# EasyEDA Pro project ProPrj_Business Card Macro Pad_2025-06-18.epro, board PCB1
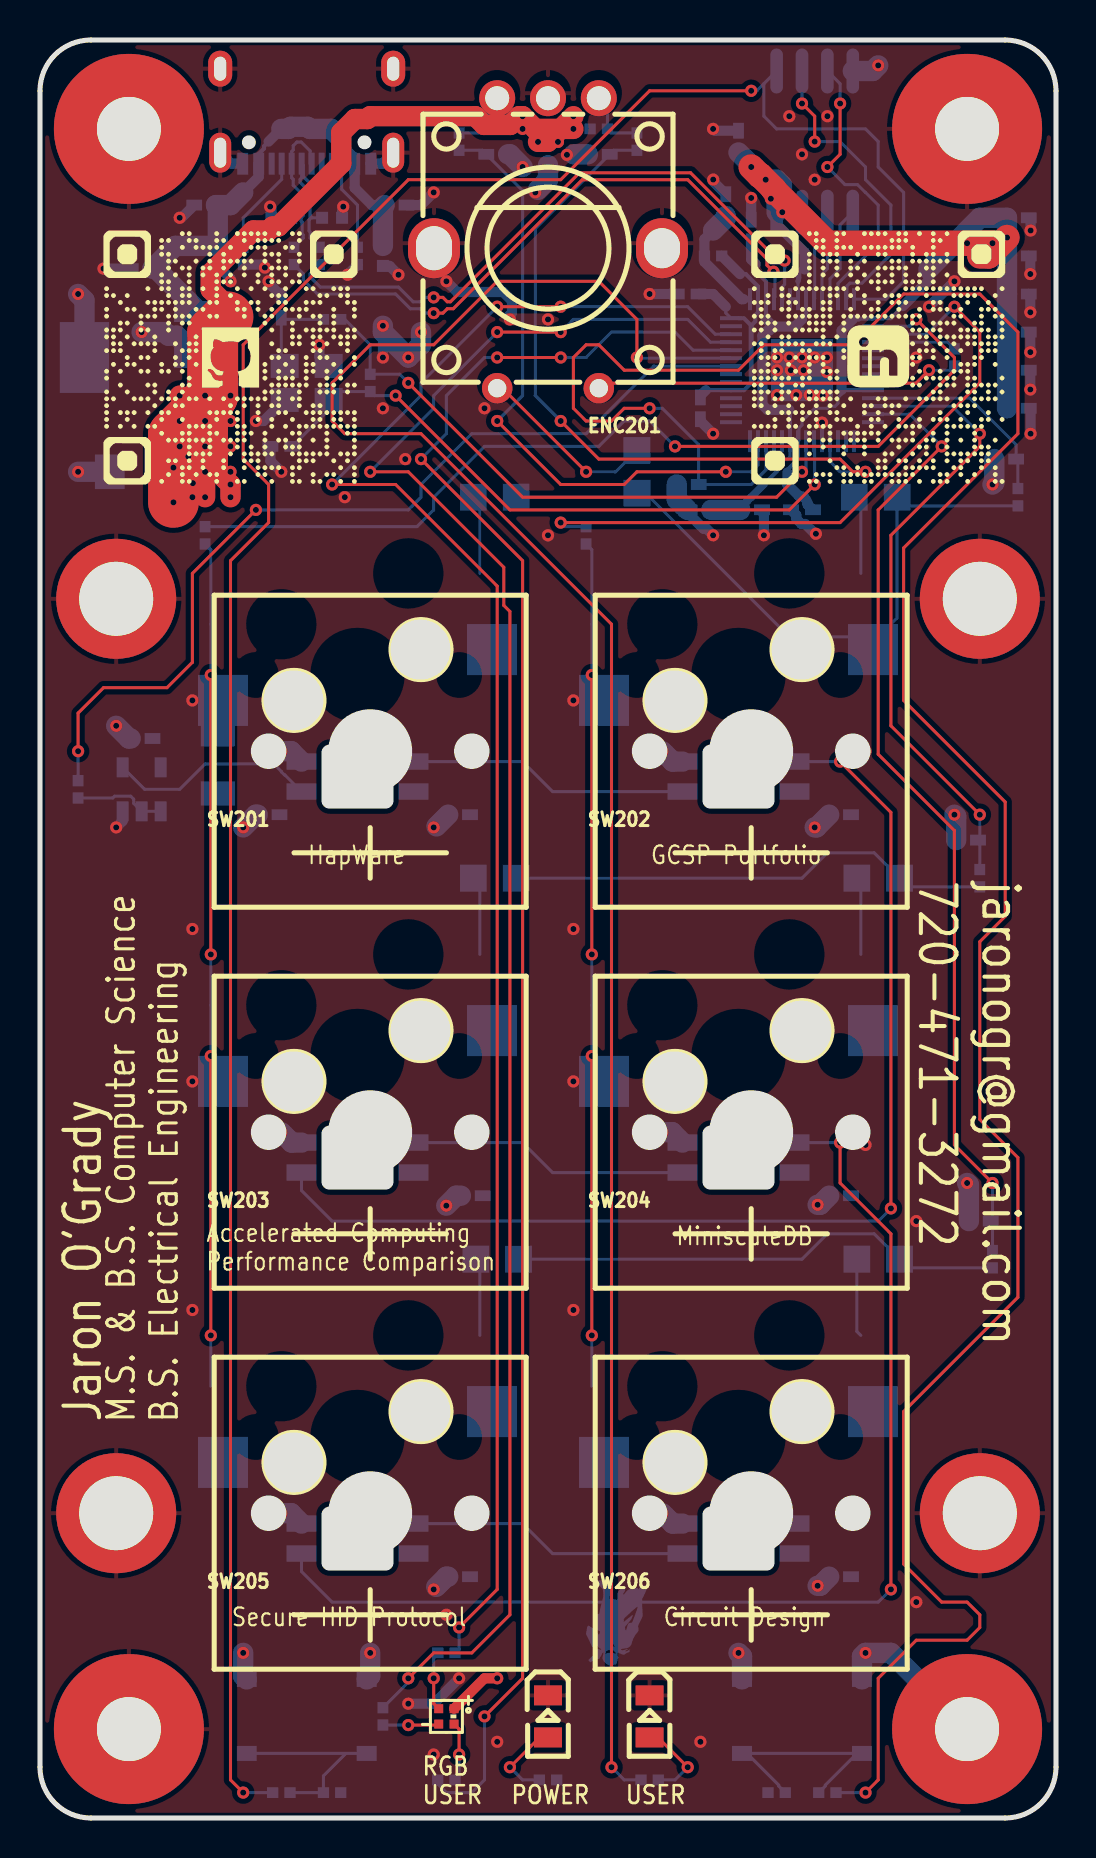
[diagram p2: board, top side]
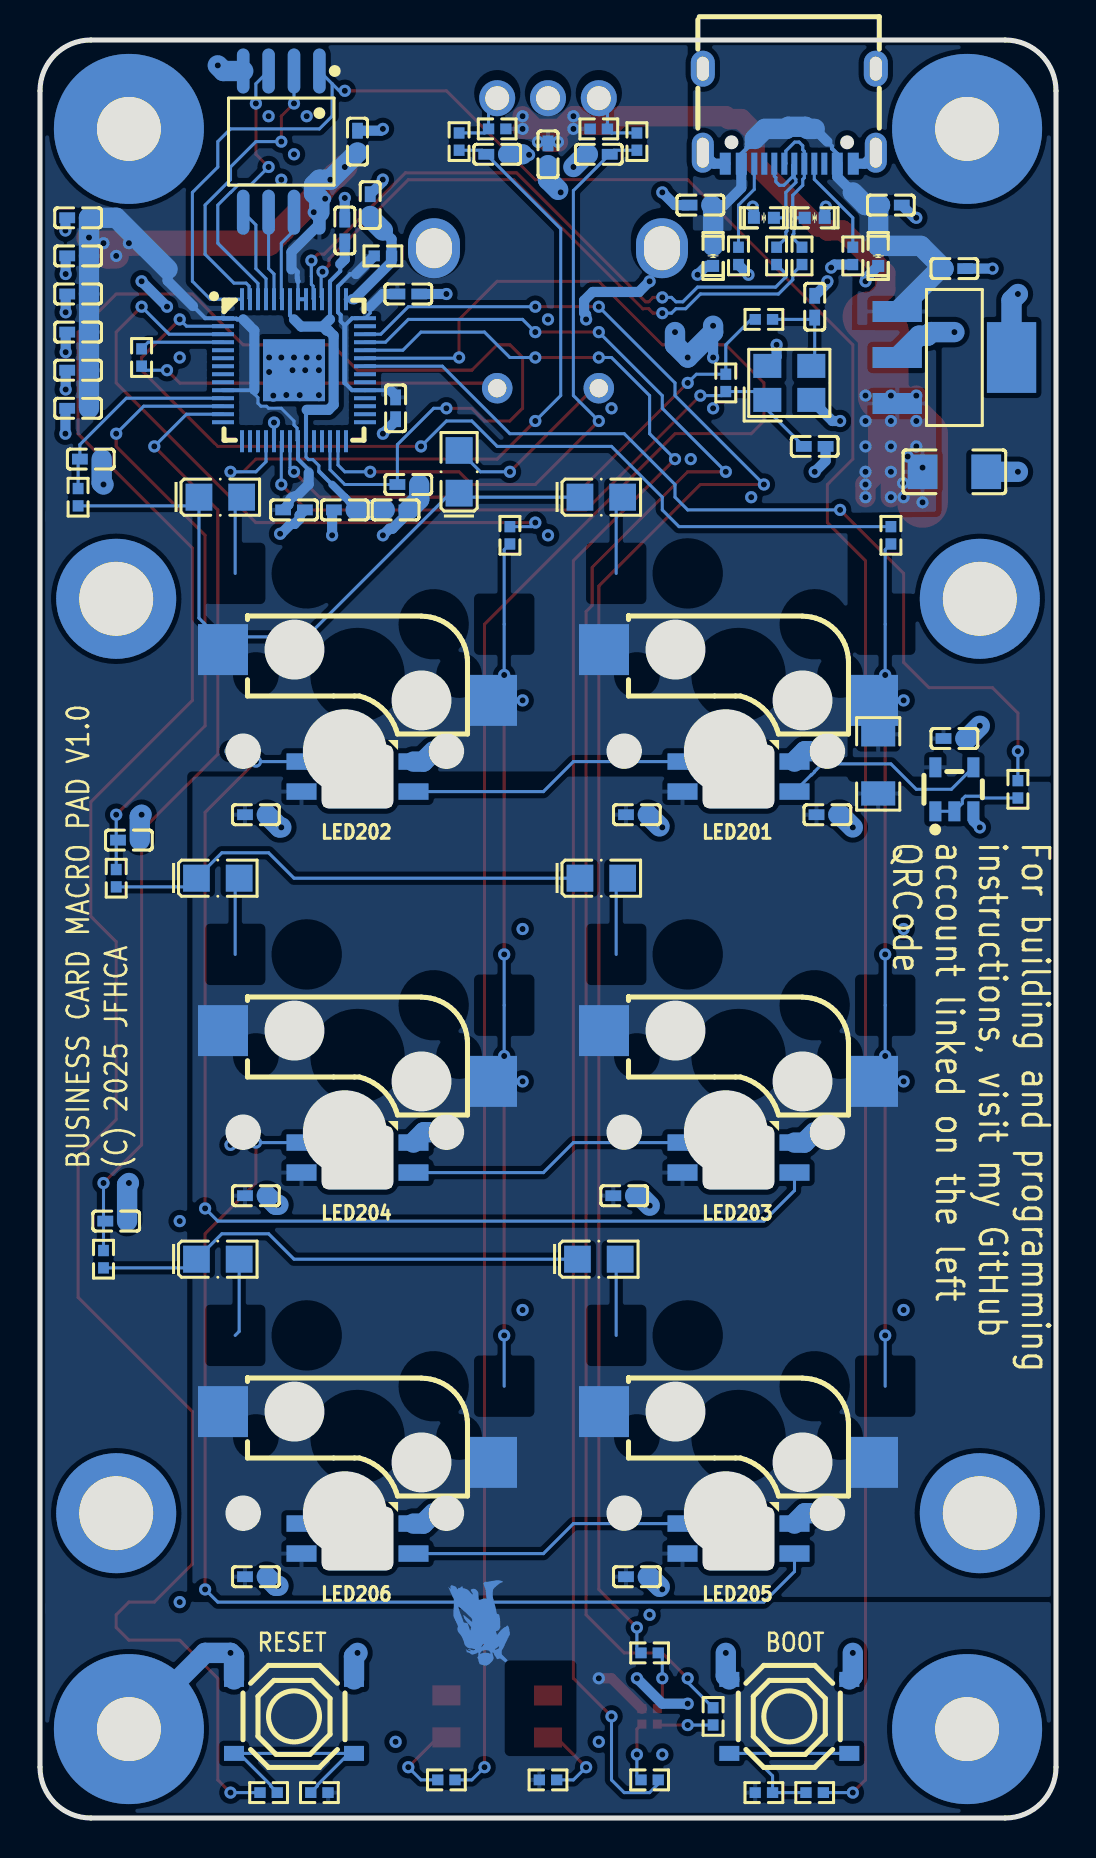
[diagram p3: board, bottom side, seen from below]

Outline 50.8 x 88.9 mm; copper layers: Top Layer, Inner1, Inner2, Bottom Layer. Coordinates in mm from the lower left corner of the outline.
Outline path: 0,86.36 arc(0.74,88.16) 2.54,88.9 48.26,88.9 arc(50.06,88.16) 50.8,86.36 50.8,2.54 arc(50.06,0.74) 48.26,0 2.54,0 arc(0.74,0.74) 0,2.54 0,86.36
Stack: Top Layer 0.035mm Outer layer thickness 1oz / Dielectric1 0.2104mm 7628 RC49% 8.6mil / Inner1 0.0152mm Inner layer thickness / Dielectric2 1.065mm 1.1mm H/HOZ Copper / Inner2 0.0152mm Inner layer thickness / Dielectric3 0.2104mm 7628 RC49% 8.6mil / Bottom Layer 0.035mm Outer layer thickness 1oz

## Design rules (mm)
net CONN_USB_N: DP1
net CONN_USB_P: DP1
net USB_N: DP2
net USB_P: DP2
template: Custom Config
spacing copperThickness1oz (default): track to track 0.178, other pairs 0.178 to 0.305
spacing copperThickness2oz: track to track 0.203, other pairs 0.152 to 0.3
track width copperThickness1oz: min 0.127, default 0.254, max 2.54
track width copperThickness2oz (default): min 0.127, default 0.152, max 2.54
differential pair differentialPair (default): width min 0.155, default 0.155, max 0.203; gap min 0.178, default 0.191
via viaSize (default): diameter min 0.61, default 0.61, max 10; hole min 0.305, default 0.305, max 6.299

## Placement (name value [footprint] x y rotation side)
C101  2.2uF  [C0402]  34.29 80.64 270 bottom
C102  1uF  [C0402]  11.43 50.17 0 bottom
C103  1uF  [C0402]  5.08 77.47 0 bottom
C104  100nF  [C0402]  35.56 79.38 270 bottom
C105  100nF  [C0402]  35.56 65.41 180 bottom
C106  2.2uF  [C0402]  33.02 65.41 0 bottom
C107  2.2uF  [C0402]  48.9 80.01 180 bottom
C108  2.2uF  [C0402]  32.38 76.2 0 bottom
C109  100nF  [C0402]  48.9 76.2 180 bottom
C110  100nF  [C0402]  48.9 78.11 180 bottom
C111  100nF  [C0402]  48.9 74.3 180 bottom
C112  100nF  [C0402]  33.02 70.48 90 bottom
C113  100nF  [C0402]  38.1 65.41 0 bottom
C114  100nF  [C0402]  48.9 70.48 180 bottom
C115  100nF  [C0402]  48.9 72.39 180 bottom
C116  47uF  [C1206]  5.08 67.31 0 bottom
C117  100nF  [C0402]  48.26 67.94 0 bottom
C118  100nF  [C0402]  46.35 48.89 0 bottom
C119  1uF  [C0402]  17.78 80.64 180 bottom
C120  1uF  [C0402]  8.25 80.64 0 bottom
C121  100nF  [C0402]  46.99 29.84 0 bottom
C123  15pF  [C0402]  12.06 68.58 180 bottom
C124  15pF  [C0402]  12.06 75.56 90 bottom
C125  100nF  [C0402]  34.93 83.82 270 bottom
C126  100nF  [C0402]  32.38 66.67 0 bottom
C127  100nF  [C0402]  5.08 53.97 0 bottom
C201  2.2uF  [C0402]  25.4 83.19 90 bottom
C203  10nF  [C0402]  27.94 83.19 0 bottom
C205  10nF  [C0402]  22.86 83.19 180 bottom
C210  100nF  [C0402]  20.96 50.17 0 bottom
C211  100nF  [C0402]  40 50.17 0 bottom
C212  100nF  [C0402]  21.59 31.11 0 bottom
C213  100nF  [C0402]  40 31.11 0 bottom
C214  100nF  [C0402]  20.96 12.06 0 bottom
C215  100nF  [C0402]  40 12.06 0 bottom
D101  GG0402052R542P  [D0402-BI]  12.06 80.01 180 bottom
D102  GG0402052R542P  [D0402-BI]  8.89 78.11 90 bottom
D103  GG0402052R542P  [D0402-BI]  17.15 78.11 90 bottom
D104  GG0402052R542P  [D0402-BI]  14.6 80.01 180 bottom
D201  CD4148WSP  [D0805-RD]  22.74 66.04 180 bottom
D202  CD4148WSP  [D0805-RD]  41.79 66.04 180 bottom
D203  CD4148WSP  [D0805-RD]  22.74 46.99 180 bottom
D204  CD4148WSP  [D0805-RD]  41.91 46.99 180 bottom
D205  CD4148WSP  [D0805-RD]  22.86 27.94 180 bottom
D206  CD4148WSP  [D0805-RD]  41.91 27.94 180 bottom
D210  CD4148WSP  [D0805-RD]  29.84 67.31 90 bottom
ENC201  PEC12R-4120F-S0012  [SW-TH_PEC12R-4120F-S0012]  25.4 78.74 180 top
J101  TYPE-C 16PIN 2MD(073)  [USB-C-SMD_TYPE-C-6PIN-2MD-073]  13.34 85.09 0 bottom
J201  CPG151101S11-16  [SMD_KEYBOARD-SW]  15.88 57.15 0 bottom
J202  CPG151101S11-16  [SMD_KEYBOARD-SW]  34.93 57.15 0 bottom
J203  CPG151101S11-16  [SMD_KEYBOARD-SW]  15.88 38.1 0 bottom
J204  CPG151101S11-16  [SMD_KEYBOARD-SW]  34.93 38.1 0 bottom
J205  CPG151101S11-16  [SMD_KEYBOARD-SW]  15.88 19.05 0 bottom
J206  CPG151101S11-16  [SMD_KEYBOARD-SW]  34.93 19.05 0 bottom
LED101  NH-B1010RGBT-HF  [LED-ARRAY-SMD_4P-L1.0-W1.0-TR_NH-B1010RGBT]  20.32 5.08 0 top
LED102  KT-0805G  [LED0805-R-RD]  25.4 5.08 270 top
LED103  KT-0805Y  [LED0805-R-RD]  30.48 5.08 270 top
LED201  SK6812MINI-E  [LED-SMD_L3.2-W2.8-LS5.9_SK6812MINI-E]  15.88 52.07 0 bottom
LED202  SK6812MINI-E  [LED-SMD_L3.2-W2.8-LS5.9_SK6812MINI-E]  34.93 52.07 0 bottom
LED203  SK6812MINI-E  [LED-SMD_L3.2-W2.8-LS5.9_SK6812MINI-E]  15.88 33.02 0 bottom
LED204  SK6812MINI-E  [LED-SMD_L3.2-W2.8-LS5.9_SK6812MINI-E]  34.93 33.02 0 bottom
LED205  SK6812MINI-E  [LED-SMD_L3.2-W2.8-LS5.9_SK6812MINI-E]  15.88 13.97 0 bottom
LED206  SK6812MINI-E  [LED-SMD_L3.2-W2.8-LS5.9_SK6812MINI-E]  34.93 13.97 0 bottom
MH201  STANDOFF_M2.5X3.2MM  [STANDOFF_M2.5X3.5MM_JO_v1.0]  3.81 15.24 0 top
MH202  STANDOFF_M2.5X3.2MM  [STANDOFF_M2.5X3.5MM_JO_v1.0]  46.99 15.24 0 top
MH203  STANDOFF_M2.5X3.2MM  [STANDOFF_M2.5X3.5MM_JO_v1.0]  3.81 60.96 0 top
MH204  STANDOFF_M2.5X3.2MM  [STANDOFF_M2.5X3.5MM_JO_v1.0]  46.99 60.96 0 top
MH205  -  [MH_7.5X3.2MM_JO_v1.0]  4.44 4.44 0 top
MH206  -  [MH_7.5X3.2MM_JO_v1.0]  4.44 84.45 0 top
MH207  -  [MH_7.5X3.2MM_JO_v1.0]  46.35 84.45 0 top
MH208  -  [MH_7.5X3.2MM_JO_v1.0]  46.35 4.44 0 top
R101  1kΩ  [R0402]  25.4 1.91 0 bottom
R102  1kΩ  [R0402]  30.48 1.91 180 bottom
R103  1kΩ  [R0402]  20.32 1.91 180 bottom
R104  1kΩ  [R0402]  17.15 5.08 90 bottom
R105  1kΩ  [R0402]  20.32 8.25 0 bottom
R106  200Ω  [R0402]  33.66 78.11 0 bottom
R107  100mΩ  [R1206]  8.89 52.7 270 bottom
R108  27Ω  [R0402]  8.25 64.14 270 bottom
R109  27Ω  [R0402]  12.7 78.11 270 bottom
R110  27Ω  [R0402]  27.31 64.14 270 bottom
R111  27Ω  [R0402]  13.97 78.11 270 bottom
R112  27Ω  [R0402]  45.72 73.03 270 bottom
R113  5.1kΩ  [R0402]  10.16 78.11 270 bottom
R114  0Ω  [R0402]  48.9 66.04 270 bottom
R115  0Ω  [R0402]  46.99 46.99 270 bottom
R116  5.1kΩ  [R0402]  15.88 78.11 90 bottom
R117  0Ω  [R0402]  47.62 27.94 270 bottom
R118  27Ω  [R0402]  1.91 51.44 270 bottom
R120  1MΩ  [R0402]  16.51 71.75 270 bottom
R121  1kΩ  [R0402]  14.6 74.93 0 bottom
R122  100kΩ  [R0402]  14.6 1.27 0 bottom
R123  10kΩ  [R0402]  36.83 1.27 180 bottom
R124  1kΩ  [R0402]  12.06 1.27 180 bottom
R125  27Ω  [R0402]  39.37 1.27 0 bottom
R201  10kΩ  [R0402]  27.94 84.45 180 bottom
R202  10kΩ  [R0402]  22.86 84.45 0 bottom
R205  10kΩ  [R0402]  29.84 83.82 90 bottom
R207  10kΩ  [R0402]  20.96 83.82 90 bottom
SW101  TS-1187A-B-A-B  [SW-SMD_4P-L5.1-W5.1-P3.70-LS6.5-TL_H1.5]  13.34 5.08 180 bottom
SW102  TS-1187A-B-A-B  [SW-SMD_4P-L5.1-W5.1-P3.70-LS6.5-TL_H1.5]  38.1 5.08 180 bottom
SW201  CPG151101D213  [KEY-TH_CPG151101D21X]  15.88 57.15 0 top
SW202  CPG151101D213  [KEY-TH_CPG151101D21X]  34.93 57.15 0 top
SW203  CPG151101D213  [KEY-TH_CPG151101D21X]  15.88 38.1 0 top
SW204  CPG151101D213  [KEY-TH_CPG151101D21X]  34.93 38.1 0 top
SW205  CPG151101D213  [KEY-TH_CPG151101D21X]  15.88 19.05 0 top
SW206  CPG151101D213  [KEY-TH_CPG151101D21X]  34.93 19.05 0 top
U101  RP2040  [LQFN-56_L7.0-W7.0-P0.4-EP]  38.1 72.39 180 bottom
U102  LM3940IMP-3.3/NOPB  [SOT-223_L6.5-W3.5-P2.30-LS7.0-BR]  5.08 73.03 0 bottom
U103  W25Q128JVSIQ  [SOIC-8_L5.3-W5.3-P1.27-LS8.0-BL]  38.74 83.82 0 bottom
U104  SN74LV1T34DBVR  [SOT-23-5_L2.9-W1.6-P0.95-LS2.8-BR]  5.08 51.44 270 bottom
Y101  ABM8-272-T3  [CRYSTAL-SMD_4P-L3.2-W2.5-BL]  13.34 71.75 180 bottom

## Footprints (pads in the part's own frame, mm; a bottom-side part is the same pattern mirrored in y, then rotated)
C0402
  rect 0.79x0.54 smd: 1(-0.545,0) 2(0.545,0)
C1206
  rect 1.485x1.728 smd: 1(-1.593,0) 2(1.593,0)
CRYSTAL-SMD_4P-L3.2-W2.5-BL
  rect 1.4x1.2 smd: 1(-1.1,-0.85) 2(1.1,-0.85) 3(1.1,0.85) 4(-1.1,0.85)
D0402-BI
  rect 0.6x0.6 smd: 1(-0.5,0) 2(0.5,0)
D0805-RD
  rect 1.335x1.35 smd: 1(-1.067,0) 2(1.067,0)
LED0805-R-RD
  rect 1x1.399 smd: 1(1.05,0) 2(-1.05,0)
LED-ARRAY-SMD_4P-L1.0-W1.0-TR_NH-B1010RGBT
  rect 0.45x0.45 smd: 1(0.385,0.385) 2(0.385,-0.385) 3(-0.385,-0.385) 4(-0.385,0.385)
LED-SMD_L3.2-W2.8-LS5.9_SK6812MINI-E
  rect 1.5x0.82 smd: 1(2.8,0.75) 2(2.8,-0.75) 3(-2.8,-0.75) 4(-2.8,0.75)
LQFN-56_L7.0-W7.0-P0.4-EP
  rect 1.1x0.2 smd: 1(-3.55,2.6) 2(-3.55,2.2) 3(-3.55,1.8) 4(-3.55,1.4) 5(-3.55,1) 6(-3.55,0.6) 7(-3.55,0.2) 8(-3.55,-0.2) 9(-3.55,-0.6) 10(-3.55,-1) 11(-3.55,-1.4) 12(-3.55,-1.8) 13(-3.55,-2.2) 14(-3.55,-2.6) 29(3.55,-2.6) 30(3.55,-2.2) 31(3.55,-1.8) 32(3.55,-1.4) 33(3.55,-1) 34(3.55,-0.6) 35(3.55,-0.2) 36(3.55,0.2) 37(3.55,0.6) 38(3.55,1) 39(3.55,1.4) 40(3.55,1.8) 41(3.55,2.2) 42(3.55,2.6)
  rect 0.2x1.1 smd: 15(-2.6,-3.55) 16(-2.2,-3.55) 17(-1.8,-3.55) 18(-1.4,-3.55) 19(-1,-3.55) 20(-0.6,-3.55) 21(-0.2,-3.55) 22(0.2,-3.55) 23(0.6,-3.55) 24(1,-3.55) 25(1.4,-3.55) 26(1.8,-3.55) 27(2.2,-3.55) 28(2.6,-3.55) 43(2.6,3.55) 44(2.2,3.55) 45(1.8,3.55) 46(1.4,3.55) 47(1,3.55) 48(0.6,3.55) 49(0.2,3.55) 50(-0.2,3.55) 51(-0.6,3.55) 52(-1,3.55) 53(-1.4,3.55) 54(-1.8,3.55) 55(-2.2,3.55) 56(-2.6,3.55)
  rect 3.1x3.1 smd: 57(0,0)
MH_7.5X3.2MM_JO_v1.0
  round 7.5 hole 3.2: 1(0,0)
R0402
  rect 0.566x0.54 smd: 1(-0.433,0) 2(0.433,0)
R1206
  rect 1.208x1.701 smd: 1(-1.479,0) 2(1.479,0)
SMD_KEYBOARD-SW
  rect 2.5x2.55 smd: 1(-6.725,1.27) 2(6.725,-1.27)
SOIC-8_L5.3-W5.3-P1.27-LS8.0-BL
  oval 0.63x2.25 smd: 1(-1.905,-3.53) 2(-0.635,-3.53) 3(0.635,-3.53) 4(1.905,-3.53) 5(1.905,3.53) 6(0.635,3.53) 7(-0.635,3.53) 8(-1.905,3.53)
SOT-23-5_L2.9-W1.6-P0.95-LS2.8-BR
  rect 1x0.6 smd: 1(1.1,-0.95) 2(1.1,0) 3(1.1,0.95) 4(-1.1,0.95) 5(-1.1,-0.95)
SOT-223_L6.5-W3.5-P2.30-LS7.0-BR
  rect 2.465x1.05 smd: 1(2.857,-2.3) 2(2.857,0) 3(2.857,2.3)
  rect 2.465x3.54 smd: 4(-2.857,0)
STANDOFF_M2.5X3.5MM_JO_v1.0
  round 6 hole 3.7: 1(0,0)
SW-SMD_4P-L5.1-W5.1-P3.70-LS6.5-TL_H1.5
  rect 1x0.75 smd: 1(-3,1.85) 2(3,1.85) 3(-3,-1.85) 4(3,-1.85)
SW-TH_PEC12R-4120F-S0012
  round 1.524 hole 0.914: 1(-2.54,7.25) 2(2.54,7.25)
  oval 2.6x3 hole 1.8x2.2: 3(5.7,0.25)
  oval 2.6x3 hole 1.8x2: 4(-5.7,0.25)
  round 1.8 hole 1.2: A(-2.54,-7.25) B(2.54,-7.25) C(0,-7.25)
USB-C-SMD_TYPE-C-6PIN-2MD-073
  rect 0.55x1.1 smd: 1(-3.2,2.375) 2(-2.4,2.375) 11(2.4,2.375) 12(3.2,2.375)
  rect 0.3x1.1 smd: 3(-1.75,2.375) 4(-1.25,2.375) 5(-0.75,2.375) 6(-0.25,2.375) 7(0.25,2.375) 8(0.75,2.375) 9(1.25,2.375) 10(1.75,2.375)
  oval 1.2x1.8 hole 0.6x1.2: 13(-4.325,-2.375) 14(4.325,-2.375)
  oval 1.1x2 hole 0.6x1.5: 13(-4.325,1.825) 14(4.325,1.825)

## Nets
As in the schematic.

Pads without a net: J101 3 9; LED206 2; U101 5 6 7 8 9 14 15 16 17 28 29 30 31 32 34 35 41

## Via types
v1: diameter 0.61, hole 0.305, Top Layer to Bottom Layer, 204 vias

## Routing (per net, layer and track width the routed paths; a pad name or vN(x,y) marks a point on that pad's centre or on a via; arc(x,y) is an arc through that point)
+1V1: length 20.7
  Bottom Layer w0.152: 36.83,67.31 36.86,67.34 36.86,67.62 37.15,67.92 37.37,67.92 37.5,68.05 U101.23
  Bottom Layer w0.203: 38.1,74.93 38.3,75.13 U101.50 ; 36.3,74.93 U101.45 36.3,76.83 35.79,77.35 35.79,77.7 ; 37.47,70.41 37.5,70.37 U101.23 ; 36.83,67.31 36.19,66.67
  Bottom Layer w0.381: C105.2 35.01,65.5 35.34,65.82 35.34,65.83 35.56,66.04 35.56,66.04 36.19,66.67
  Bottom Layer w0.508: 35.79,77.7 35.56,77.93 C104.2 ; 36.66,74.57 36.46,74.37 36.37,74.37 36.12,74.12 36.12,70.66 36.37,70.41 37.47,70.41 ; 36.66,74.57 37.74,74.57 38.1,74.93 ; 36.66,74.57 36.3,74.93
  Bottom Layer w1.016: C106.2 C105.2
+3V3: length 123.4
  Top Layer w0.508: v1(22.86,6.99) 22.22,6.99 LED101.1
  Top Layer w1.016: 26.03,84.45 25.39,83.81 v1(24.9,83.81) ; 26.03,84.45 v1(26.67,85.09) ; 26.03,84.45 v1(26.67,84.45) ; 26.03,84.45 24.76,84.45 v1(24.13,85.09) 23.95,85.09 23.52,84.65 22.2,84.65 21.77,85.09 16.51,85.09 16.37,84.95 15.74,84.95 15.06,84.27 15.06,82.72 11.92,79.58 11.63,79.58 11.43,79.38 10.66,79.38 8.53,77.25 8.53,76.42 9.4,75.56 9.4,75.06 ; v1(8.25,69.85) v1(6.98,71.12) ; v1(8.25,69.85) 8.89,69.85 8.89,67.31 v1(9.53,66.67) v1(9.53,66.04) ; v1(8.25,69.85) v1(8.25,68.58) v1(8.25,67.31) v1(8.25,66.04)
  Top Layer w1.27: v1(47.62,78.74) v1(46.35,78.74) 39.37,78.74 36.68,81.43 36.68,81.47 36.02,82.12 35.99,82.12 v1(35.56,82.55) ; v1(46.99,78.11) 47.43,78.11 v1(48.35,79.02)
  Top Layer w2.54: v1(6.67,65.78) v1(6.67,67.52) 6.67,69.16 8.64,71.12 8.64,74.29 9.4,75.06
  Bottom Layer w0.152: U101.49 37.9,76.83 ; 40.08,71.4 40.08,71.2 39.9,71.02 39.9,70.73 39.75,70.59 39.47,70.59 39.37,70.48 38.74,70.48 38.1,69.85 38.1,69.65 37.95,69.5 37.95,68.89 U101.22 ; 35.19,74.99 35.22,74.97 ; C112.2 33.02,71.12 ; 34.29,75.56 34.29,75.25 U101.42 34.93,74.99
  Bottom Layer w0.203: 43.15,75.59 42.54,74.99 U101.1 41.63,74.97 40.98,74.97 40.94,74.93 40.64,74.93 ; 35.56,71.75 35.19,71.39 U101.33 33.29,71.39 ; U101.10 40.09,71.39 40.08,71.4 ; 35.22,74.97 35.56,74.62 35.77,74.83 35.77,75.15 35.9,75.28 U101.44 35.9,76.58 35.29,77.19 35,77.19 ; U101.48 U101.49 ; 34.93,74.99 35.19,74.99 ; U101.22 37.9,67.94 37.37,67.41
  Bottom Layer w0.254: 35.56,74.62 35.56,71.75 ; 37.9,76.83 37.9,76.84 arc(37.93,76.92) 37.94,77.01 37.94,77.31 38.06,77.43 38.23,77.43
  Bottom Layer w0.508: 40.08,71.4 40.08,74.37 40.64,74.93 ; C113.2 38.38,65.67 38.38,65.67 arc(38.26,65.98) 37.95,66.11 37.94,66.11 37.37,66.69 37.37,67.26 ; 44.42,77.44 44.42,76.86 43.15,75.59 ; U103.8 36.83,79.69 38.23,78.3 38.23,77.43 ; 33.02,71.12 33.29,71.39 ; 34.29,75.56 33.66,76.2 C108.2 ; 35,77.19 R106.2
  Bottom Layer w1.016: U103.8 36.83,80.96 37.1,81.23 37.1,81.65 36.83,81.92 v1(36.28,81.92) 34.93,83.28 ; C114.2 C115.2 C111.2 C109.2 C110.2 v1(48.35,79.02) C107.2 46.99,80.01 44.42,77.44
  vias: v1(6.98,69.85) v1(6.98,68.58) v1(7.42,68.07) v1(7.64,66.74) v1(7.62,66.04) v1(8.25,71.12) v1(9.53,71.12) v1(9.53,69.85) v1(9.53,68.58) v1(9.53,67.31) v1(24.13,84.45) v1(25.9,83.81) v1(36.54,80.96) v1(37.11,80.29)
+3V3_A: length 5.8
  Bottom Layer w0.229: U101.43 35.19,75.94
  Bottom Layer w0.508: 35.19,75.94 35.09,75.94 33.22,77.81 R106.1 33.22,78.94 33.66,79.38
  Bottom Layer w1.016: 33.66,79.38 34.29,80.01 C101.2
+5V_USB: length 24.6
  Bottom Layer w0.203: 11.43,83.82 11.2,83.59 11.2,83.47 10.94,83.21 J101.2 ; 15.32,83.7 15.47,83.54 15.47,83.47 15.74,83.21 J101.11
  Bottom Layer w0.508: J101.11 15.74,81.5 16.59,80.64 C119.2 ; 15.06,83.95 15.32,83.7 ; J101.2 10.94,82.06 10.16,81.28 ; 11.43,83.82 12.06,84.45
  Bottom Layer w1.016: D103.2 17.15,80.56 C119.2 ; 12.06,84.45 12.42,84.45 12.53,84.56 13.38,84.56 13.49,84.45 14.56,84.45 15.06,83.95 ; 10.16,81.28 9.53,80.64 C120.2 8.89,80.56 D102.2 6.76,78.61 C103.2 5.79,77.47 U102.1
GND: length 95.7
  Bottom Layer w0.203: U101.19 v1(39.1,69.77)
  Bottom Layer w0.508: J101.14 17.11,82.72 J101.12 ; v1(49.52,75.29) 49.52,76.12 C109.1 ; U104.3 4.13,49.85 v1(3.81,49.53) ; C125.1 33.75,84.36 v1(33.66,84.45) ; C107.1 49.53,79.92 v1(49.53,79.38) ; v1(6.98,80.01) 7.08,80.01 C120.1 ; v1(9.53,76.83) 9.53,76.97 D102.1 ; D104.1 15.1,80.51 v1(15.16,80.57) ; 17.15,74.3 v1(17.15,73.03) ; C124.2 11.43,76.75 v1(11.43,76.83) ; C111.1 49.52,74.22 v1(49.52,73.29) ; v1(18.41,5.72) 19.69,5.72 v1(20.96,6.99) ; v1(19.69,81.28) 19.05,80.64 C119.1 ; v1(49.52,77.2) 49.52,78.03 C110.1 ; v1(49.52,71.42) 49.52,72.31 C115.1 ; v1(17.92,77.16) 17.48,77.61 D103.1 ; D101.2 11.56,80.51 v1(11.51,80.57) ; C112.1 33.02,69.85 v1(33.66,69.22) ; R116.1 15.88,77.66 v1(15.38,77.16) ; v1(49.53,69.22) 49.53,70.39 C114.1 ; C108.1 v1(30.48,76.2) ; v1(11.24,77.52) 11.09,77.67 R113.2 ; v1(44.45,75.56) v1(45.72,76.83) ; C123.2 11.52,67.86 v1(12.06,67.31) ; v1(36.19,64.14) 36.19,65.31 C105.1 ; 10.13,82.72 9.56,82.72 J101.13 ; C103.1 v1(3.17,77.47) ; v1(33.66,64.14) 33.32,64.47 33.18,64.47 32.47,65.17 C106.1 ; Y101.4 13.97,73.07 v1(13.97,73.66) ; v1(20.32,76.83) 20.85,76.3 23.16,76.3 23.6,75.87 23.6,75.26 23.5,75.16 v1(23.5,74.93) ; v1(33.66,81.92) 33.66,81.82 C101.1 ; C104.1 v1(35.56,81) ; Y101.2 11.18,69.85 v1(10.79,69.85) ; v1(38.8,64.21) 38.75,64.21 38.26,64.7 38.07,64.7 37.82,64.96 37.82,65.14 C113.1
  Bottom Layer w1.016: v1(45.72,50.17) 45.81,50.08 C118.1 ; v1(17.15,74.61) 17.15,74.3 v1(18.41,73.03) 19.05,73.66 v1(19.05,74.3) ; LED206.3 31.63,14.72 v1(31.12,15.24) ; v1(38.88,30.66) 39.01,30.66 C213.1 ; LED204.3 31.6,34.29 v1(31.12,34.29) ; v1(5.08,74.3) 6.24,74.3 6.42,74.11 6.85,74.11 U102.2 ; v1(20.31,30.62) 20.81,31.11 21.04,31.11 ; v1(10.16,49.53) 10.79,50.17 10.88,50.17 ; LED202.3 31.63,52.82 v1(31.12,53.34) ; 24.89,81.41 25.4,81.92 C201.1 ; 19.81,11.56 20.32,12.06 C214.1 ; v1(1.91,76.2) 2.22,75.88 U102.4 ; LED203.3 12.59,33.77 v1(12.06,34.29) ; 12.13,53.34 12.56,53.34 LED201.3 ; C116.1 v1(1.91,67.31) ; v1(10.16,8.25) 10.16,7.1 SW101.2 ; v1(3.81,54.61) 4.44,53.97 C127.1 ; SW102.1 41.1,8.08 v1(41.28,8.25) 42.54,8.25 MH208.1 ; v1(38.88,11.61) 39.01,11.61 C215.1 ; v1(24.13,82.55) 23.5,83.19 C205.1 ; v1(16.51,8.25) 16.51,7.1 SW101.1 ; C211.1 38.82,49.53 v1(38.74,49.53) ; C203.1 26.68,83.19 ; v1(34.93,8.25) 35.1,8.08 SW102.2 ; 32.37,65.41 31.84,65.94 C126.1 ; C210.1 19.83,49.58 ; v1(46.35,31.75) 46.44,31.66 46.44,29.84 ; LED205.3 12.56,15.24 v1(12.06,15.24) ; v1(47.62,66.67) 47.72,66.77 C117.1 ; v1(41.91,87.63) 41.63,87.35 U103.4
  vias: v1(7.62,55.88) v1(7.62,44.45) v1(7.62,36.83) v1(7.62,25.4) v1(12.06,53.34) v1(15.24,66.04) v1(17.15,70.48) v1(18.26,67.94) v1(19.69,49.53) v1(19.69,11.43) v1(19.69,3.18) v1(20.32,10.16) v1(22.22,70.48) v1(22.86,3.81) v1(24.76,81.28) v1(25.4,74.93) v1(25.4,64.14) v1(26.35,83.16) v1(26.67,55.88) v1(26.67,44.45) v1(26.67,36.83) v1(26.67,25.4) v1(33.02,3.81) v1(36.85,73.03) v1(36.85,72.39) v1(36.85,71.14) v1(37.47,85.09) v1(37.47,73.03) v1(37.54,72.39) v1(37.81,71.14) v1(38.1,83.19) v1(38.1,73.03) v1(38.18,72.39) v1(38.48,71.15) v1(38.74,81.92) v1(38.74,73.03) v1(39.14,71.12) v1(39.34,73.03) v1(39.34,72.3) v1(39.37,85.09) v1(41.28,53.34) v1(41.28,33.66) v1(43.81,73.03) v1(43.81,29.84) v1(43.81,10.79)
COL0: length 42.2
  Top Layer w0.152: v1(8.54,24.13) v1(8.54,38.1) ; v1(8.54,43.18) v1(8.54,57.15)
  Bottom Layer w0.152: 8.54,21.59 v1(8.54,24.13) ; R108.2 8.54,63.42 v1(8.54,57.15) ; v1(8.54,43.18) v1(8.54,38.1)
COL0_R: length 47.8
  Top Layer w0.152: v1(31.75,68.58) 41.91,68.58 45.72,72.39 45.72,73.03 v1(43.81,74.93)
  Bottom Layer w0.152: R108.1 18.85,64.57 19.69,65.41 19.69,66.04 22.22,68.58 27.94,68.58 29.21,69.85 30.48,69.85 v1(31.75,68.58) ; U101.2 43.47,74.59 v1(43.81,74.93)
COL1: length 42.2
  Top Layer w0.152: v1(27.59,43.18) v1(27.59,57.15) ; v1(27.59,24.13) v1(27.59,38.1)
  Bottom Layer w0.152: R110.2 27.59,63.42 v1(27.59,57.15) ; 27.59,21.59 v1(27.59,24.13) ; v1(27.59,43.18) v1(27.59,38.1)
COL1_R: length 34.2
  Top Layer w0.152: v1(26.03,64.77) 40,64.77 46.99,71.75 46.99,74.3 v1(45.72,75.56)
  Bottom Layer w0.152: U101.3 44.34,74.19 v1(45.72,75.56) ; v1(26.03,64.77) 26.24,64.57 R110.1
COL2: length 18.1
  Top Layer w0.152: 27.94,71.74 43.8,71.74 v1(44.45,72.39)
  Bottom Layer w0.152: R112.2 45.52,72.39 v1(44.45,72.39)
COL2_R: length 4.2
  Bottom Layer w0.152: R112.1 45.39,73.79 U101.4
CONN_USB_N: length 7.9
  Bottom Layer w0.155: 13.05,80.01 13.05,79.86 13.11,79.8 13.11,79.21 13.16,79.16 13.16,79 R109.1 ; 13.05,80.01 13.16,80.12 13.16,81.14 12.66,81.64 12.66,81.93 12.59,82.01 J101.5 12.59,83.33 12.66,83.41 12.66,83.61 12.84,83.8 13.06,83.8 13.51,83.35 13.51,82.72 J101.7 ; 13.05,80.01 D101.1
CONN_USB_P: length 8
  Bottom Layer w0.155: 13.51,80.12 13.62,80.01 D104.2 ; 13.51,80.12 13.51,79.96 13.45,79.91 13.45,79.35 13.51,79.3 13.51,79 R111.1 ; 13.51,80.12 13.51,81.28 13.01,81.78 13.01,81.93 13.09,82.01 J101.6 13.16,82.64 13.16,82.08 13.61,81.63 13.82,81.63 14.01,81.82 14.01,82.02 14.09,82.1 J101.8
ENC1_A: length 36.1
  Top Layer w0.152: v1(26.03,69.85) 27.94,67.94 40,67.94 40.64,67.31 v1(41.28,67.31)
  Bottom Layer w0.152: v1(26.03,69.85) 24.76,71.12 24.76,79.47 C203.2 28.69,83.39 29.84,83.39 ; v1(41.28,67.31) 40,67.31 39.5,67.81 U101.18
ENC1_B: length 32
  Top Layer w0.152: v1(22.86,69.85) 26.03,66.67 29.21,66.67 29.84,67.31 v1(34.29,67.31)
  Bottom Layer w0.152: U101.27 35.9,67.65 35.56,67.31 v1(34.29,67.31) ; 20.96,83.39 22.11,83.39 C205.2 24.13,81.37 24.13,71.12 v1(22.86,69.85)
ENC1_SW: length 9.3
  Top Layer w0.152: v1(27.31,67.31) 22.88,71.74 22.86,71.74
  Bottom Layer w0.152: D210.2 28.78,67.31 v1(27.31,67.31)
LED0_BUF: length 4.6
  Bottom Layer w0.152: R118.2 3.64,51 3.72,51.09 4.54,51.09 4.68,50.94 4.68,50.73 U104.2 U104.1
LED0_DIN: length 10.5
  Bottom Layer w0.152: U104.4 5.23,51.44 6.98,51.44 8.25,52.7 11.69,52.7 12.07,52.32 12.07,52.31 12.22,52.16 12.24,52.16 LED201.4
LED0_RES: length 46.2
  Top Layer w0.152: v1(1.91,53.34) 1.91,55.25 3.17,56.52 6.35,56.52 7.62,57.78 7.62,62.23 v1(10.79,65.41)
  Bottom Layer w0.152: U101.36 30.68,72.59 27.31,69.22 21.59,69.22 19.05,66.67 19.05,66.04 18.41,65.41 v1(10.79,65.41) ; v1(1.91,53.34) R118.1
LED1_DIN: length 14.1
  Bottom Layer w0.152: LED202.4 25.63,51.32 24.13,52.82 LED201.2
LED2_DIN: length 56.9
  Top Layer w0.152: v1(40,52.82) 42.54,50.28 v1(42.54,30.48)
  Bottom Layer w0.152: 37.72,52.82 v1(40,52.82) ; LED203.4 13.07,31.38 14.6,29.84 41.91,29.84 v1(42.54,30.48)
LED3_DIN: length 14.1
  Bottom Layer w0.152: LED204.4 25.63,32.27 24.13,33.77 LED203.2
LED4_DIN: length 56.9
  Top Layer w0.152: v1(42.54,11.43) 42.54,29.21 40,31.75 v1(40,33.77)
  Bottom Layer w0.152: 37.72,33.77 v1(40,33.77) ; v1(42.54,11.43) 41.91,10.79 14.6,10.79 13.07,12.32 LED205.4
LED5_DIN: length 14.1
  Bottom Layer w0.152: LED206.4 25.63,13.22 24.13,14.72 LED205.2
QSPI_SCLK: length 4.5
  Bottom Layer w0.152: U103.6 39.37,77.47 39.1,77.2 U101.52
QSPI_SD0: length 4.8
  Bottom Layer w0.152: U103.5 40,79.66 40,77.47 39.5,76.97 U101.53
QSPI_SD1: length 15.3
  Top Layer w0.152: v1(38.74,83.82) 38.74,85.09 v1(38.1,85.72)
  Bottom Layer w0.152: v1(38.1,85.72) U103.2 ; U101.55 40.35,75.99 40.35,76.59 40.49,76.74 41.1,76.74 42.54,78.19 42.54,80.64 41.28,81.92 41.28,82.55 40,83.82 v1(38.74,83.82)
QSPI_SD2: length 14.2
  Top Layer w0.152: v1(40,85.72) 40,83.19 v1(39.37,82.55)
  Bottom Layer w0.152: v1(40,85.72) 40,86.72 U103.3 ; U101.54 39.9,76.73 41.91,78.74 41.91,80.64 41.28,81.28 41.26,81.28 40.88,81.67 40.25,81.67 v1(39.37,82.55)
QSPI_SD3: length 4.6
  Bottom Layer w0.152: U101.51 38.74,75.97 38.74,78.74 38.1,79.38 U103.7
QSPI_SS: length 126
  Top Layer w0.152: v1(35.56,86.36) 30.48,86.36 26.03,81.92 18.41,81.92 10.16,73.66 10.16,67.94 11.43,66.67 11.43,64.77 9.53,62.86 9.53,1.91 v1(10.16,1.27)
  Bottom Layer w0.152: v1(35.56,86.36) 35.84,86.36 36.19,86.72 ; U103.1 36.19,86.72 ; 36.19,86.72 36.19,85.09 36.83,84.45 41.28,84.45 41.91,83.82 41.91,82.55 43.18,81.28 43.18,76.83 42.28,75.94 U101.56 ; v1(10.16,1.27) R124.2
RESET_N: length 131.4
  Top Layer w0.152: v1(41.28,1.27) 41.91,1.91 41.91,6.99 43.81,8.89 46.35,8.89 46.99,9.53 46.99,10.16 46.35,10.79 45.09,10.79 43.18,12.7 43.18,20.32 48.9,26.03 48.9,33.02 46.99,34.92 46.99,43.81 48.26,45.08 48.26,50.8 43.18,55.88 43.18,63.5 48.9,69.22 48.9,74.3 46.99,76.2 43.18,76.2 40.64,73.66 36.19,73.66 34.93,72.39 29.21,72.39 27.94,73.66 27.31,73.66 26.67,73.03 26.67,70.48 27.31,69.85 28.57,69.85 29.21,70.48 v1(30.48,70.48)
  Bottom Layer w0.152: U101.26 36.3,67.42 35.56,66.67 C126.2 32.93,68.67 31.12,70.48 v1(30.48,70.48) ; v1(41.28,1.27) R125.2
ROW0: length 34.8
  Bottom Layer w0.152: R114.2 43.29,65.61 D202.1 42.85,60 41.91,59.06 37.47,59.06 30.28,66.24 D210.1 29.64,66.04 D201.1
ROW0_R: length 10.4
  Bottom Layer w0.152: U101.11 46.49,70.99 48.81,68.67 C117.2 48.9,67.86 48.9,66.47
ROW1: length 24.4
  Bottom Layer w0.152: D203.1 38.1,46.99 39.37,48.26 41.71,48.26 D204.1 43.41,46.56 R115.2
ROW1_R: length 31.5
  Top Layer w0.152: v1(46.99,69.22) 46.99,68.58 42.54,64.14 42.54,54.61 v1(46.99,50.17)
  Bottom Layer w0.152: v1(46.99,50.17) 46.99,48.98 C118.2 46.99,48.81 R115.1 ; U101.12 45.62,70.59 v1(46.99,69.22)
ROW2: length 24.9
  Bottom Layer w0.152: D205.1 38.1,27.94 39.37,29.21 41.71,29.21 D206.1 43.41,27.51 47.62,27.51
ROW2_R: length 48.1
  Top Layer w0.152: v1(47.62,31.75) 45.72,33.66 45.72,49.37 41.91,53.18 41.91,65.41 v1(45.09,68.58)
  Bottom Layer w0.152: v1(47.62,31.75) 47.62,29.94 C121.2 47.62,29.75 R117.1 ; U101.13 43.47,70.19 v1(45.09,68.58)
USB_N: length 31.4
  Top Layer w0.155: v1(19.69,75.24) 20.14,75.24 20.37,75.46 20.66,75.46 27.12,81.92 32.38,81.92 36.35,77.95 36.35,77.64 v1(36.67,77.31)
  Bottom Layer w0.155: v1(19.69,75.24) 19.23,75.24 19,75.46 18.52,75.46 17.78,76.2 13.87,76.2 13.16,76.91 13.16,77.21 R109.2 ; U101.46 36.7,76 36.74,76.05 36.74,77.24 v1(36.67,77.31)
USB_P: length 31.7
  Top Layer w0.155: v1(37.23,77.87) 36.91,78.2 36.59,78.2 32.53,82.26 26.97,82.26 20.52,75.81 20.37,75.81 20.14,76.03 v1(19.69,76.03)
  Bottom Layer w0.155: R111.2 13.51,77.21 13.51,77.06 14.02,76.55 17.92,76.55 18.66,75.81 19,75.81 19.23,76.03 v1(19.69,76.03) ; v1(37.23,77.87) 37.23,77.55 37.23,77.55 37.23,77.08 37.23,77.08 37.23,76.68 37.15,76.6 37.15,75.96 37.13,75.94 U101.47
USER_LED1: length 103.7
  Top Layer w0.152: v1(29.84,73.03) 29.84,74.93 27.94,76.83 22.86,76.83 19.69,73.66 16.51,73.66 14.6,71.75 14.6,69.85 15.24,69.22 19.05,69.22 28.57,59.69 v1(28.57,2.54)
  Bottom Layer w0.152: v1(29.84,73.03) 29.88,72.99 U101.37 ; v1(28.57,2.54) 29.21,1.91 R102.2
USER_LED2_B: length 89.1
  Top Layer w0.152: v1(14.6,66.67) 17.78,66.67 22.86,61.59 22.86,11.43 v1(20.96,9.53) ; v1(22.86,75.56) v1(26.03,75.56)
  Bottom Layer w0.152: v1(14.6,66.67) 19.05,71.12 19.05,71.75 v1(22.86,75.56) ; v1(26.03,75.56) 32.38,75.56 33.76,74.19 U101.40 ; R105.2 20.96,8.46 v1(20.96,9.53)
USER_LED2_G: length 91.6
  Top Layer w0.152: v1(16.51,67.31) 18.41,67.31 23.19,62.53 23.19,60.63 23.5,60.33 23.5,10.16 21.59,8.25 19.69,8.25 v1(18.41,6.99) ; v1(26.03,74.3) v1(22.86,74.3)
  Bottom Layer w0.152: v1(18.41,6.99) 18.41,6.78 R104.2 ; v1(16.51,67.31) 19.69,70.48 19.69,71.12 v1(22.86,74.3) ; v1(26.03,74.3) 26.67,74.93 32.38,74.93 33.53,73.79 U101.39
USER_LED2_R: length 91.5
  Top Layer w0.152: v1(19.05,67.94) 24.13,62.86 24.13,6.99 v1(22.22,5.08) ; v1(22.86,73.03) v1(26.03,73.03)
  Bottom Layer w0.152: v1(22.86,73.03) 22.22,73.03 20.32,71.12 20.32,69.22 v1(19.05,67.94) ; v1(22.22,5.08) 22.22,1.91 21.59,1.27 20.32,1.27 19.89,1.7 R103.2 ; v1(26.03,73.03) 27.31,73.03 28.57,74.3 31.75,74.3 32.66,73.39 U101.38
X_R: length 4.6
  Bottom Layer w0.152: R121.1 12.16,74.93 C124.1 12.06,72.78 Y101.3
XIN: length 32.7
  Top Layer w0.152: v1(38.74,66.67) 37.47,65.41 23.5,65.41 v1(17.78,71.12)
  Bottom Layer w0.152: v1(17.78,71.12) 16.71,71.12 R120.2 14.85,71.32 Y101.1 14.44,70.41 C123.1 ; U101.20 38.74,68.81 v1(38.74,66.67)
XOUT: length 29.7
  Top Layer w0.152: v1(38.1,67.31) 36.83,66.04 24.13,66.04 v1(18.41,71.75)
  Bottom Layer w0.152: v1(38.1,67.31) 38.3,67.51 U101.21 ; v1(18.41,71.75) 17.98,72.19 R120.1 16.51,73.66 15.24,74.93 R121.2
$2N5165: length 4.5
  Bottom Layer w0.152: J101.10 15.09,81.44 15.88,80.64 R116.2
$2N5312: length 5
  Bottom Layer w0.152: J101.4 12.09,81.94 10.16,80.01 R113.1
$2N7553: length 10.1
  Bottom Layer w0.152: 15.29,3.23 SW101.4 ; 15.29,3.23 SW101.3 ; 15.29,3.23 14.17,2.11 R122.1 R124.1
$2N9130: length 11.5
  Bottom Layer w0.152: 35.35,3.23 36.93,1.65 36.93,1.6 R123.1 ; 35.35,3.23 SW102.4 ; 35.35,3.23 40.85,3.23 ; SW102.3 40.85,3.23 ; 40.85,3.23 39.27,1.65 39.27,1.6 R125.1
$2N9506: length 4.3
  Top Layer w0.152: v1(32.38,2.54) 30.9,4.03 LED103.1
  Bottom Layer w0.152: R102.1 31.75,1.91 v1(32.38,2.54)
$2N9799: length 4.3
  Top Layer w0.152: LED102.1 24.98,4.03 v1(23.5,2.54)
  Bottom Layer w0.152: v1(23.5,2.54) 24.13,1.91 R101.1
$2N17924: length 3
  Top Layer w0.152: v1(20.96,3.18) 20.96,4.44 LED101.2
  Bottom Layer w0.152: R103.1 20.96,2.11 v1(20.96,3.18)
$2N17928: length 2.8
  Top Layer w0.152: v1(18.41,4.65) 19.89,4.65 LED101.3
  Bottom Layer w0.152: R104.1 v1(18.41,4.65)
$2N17934: length 3
  Top Layer w0.152: LED101.4 19.69,5.72 v1(19.69,6.99)
  Bottom Layer w0.152: v1(19.69,6.99) 19.69,8.05 R105.1
$3N790: length 3.9
  Bottom Layer w0.152: D201.2 21.99,65.72 21.99,62.23
$3N2565: length 3.9
  Bottom Layer w0.152: D202.2 41.04,65.72 41.04,62.23
$3N2675: length 3.9
  Bottom Layer w0.152: 21.99,43.18 21.99,46.67 D203.2
$3N3001: length 3.9
  Bottom Layer w0.152: 41.04,43.18 41.04,46.79 D204.2
$3N3003: length 3.9
  Bottom Layer w0.152: 21.99,24.13 21.99,27.74 D205.2
$3N3005: length 3.9
  Bottom Layer w0.152: D206.2 40.84,24.33 41.04,24.13
$3N3982: length 3.5
  Bottom Layer w0.152: R205.2 28.57,84.25 R201.1 28.37,85.81 27.94,86.24
$3N4003: length 3.5
  Bottom Layer w0.152: 22.86,86.24 22.43,85.81 R202.1 22.22,84.25 R207.2

## Copper pours and planes (outline as drawn; the poured copper is in the pictures)
+3V3 on Bottom Layer: 18.41,88.9 18.41,79.12 10.16,79.05 10.2,74.4 5.99,74.36 5.99,65.31 50.8,64.76 50.8,88.9
+3V3 on Bottom Layer: 50.8,10.16 42.54,10.16 42.54,10.79 43.18,11.43 43.18,52.07 10.12,52.07 10.12,65.41 50.8,65.41
+3V3 on Bottom Layer: 22.86,85.17 27.88,85.17 27.88,83.76 22.86,83.76
+3V3 on Bottom Layer: 0,10.79 50.8,10.79 50.8,0 0,0
+5V_LEDS on Bottom Layer: 0,52.07 43.18,52.07 43.18,11.25 42.72,10.79 0,10.79
+5V_USB on Bottom Layer: 0,88.9 18.41,88.9 18.41,76.83 13.16,76.83 13.16,79.11 10.22,79.11 10.16,79.05 10.16,74.16 5.72,74.16 5.72,65.41 10.16,65.41 10.16,52.07 0,52.07
GND on Top Layer: 0,88.9 50.8,88.9 50.8,0 0,0

Small or netless copper shapes (teardrops, artwork), in the pictures only: 2 on Bottom Layer

## Text on the board
Bottom Silkscreen Layer: BOOT | RESET | (C) 2025 JFHCA | BUSINESS CARD MACRO PAD V1.0 | For building and programming / instructions, visit my GitHub / account linked on the left / QRCode
Top Silkscreen Layer: Accelerated Computing / Performance Comparison | Secure HID Protocol | HapWare | GCSP Portfolio | Circuit Design | MinisculeDB | RGB / USER | POWER | USER | M.S. & B.S. Computer Science / B.S. Electrical Engineering | Jaron O'Grady | 720-471-3272 | jaronogr@gmail.com
